# EAGLE design robot (EAGLE 6.3)
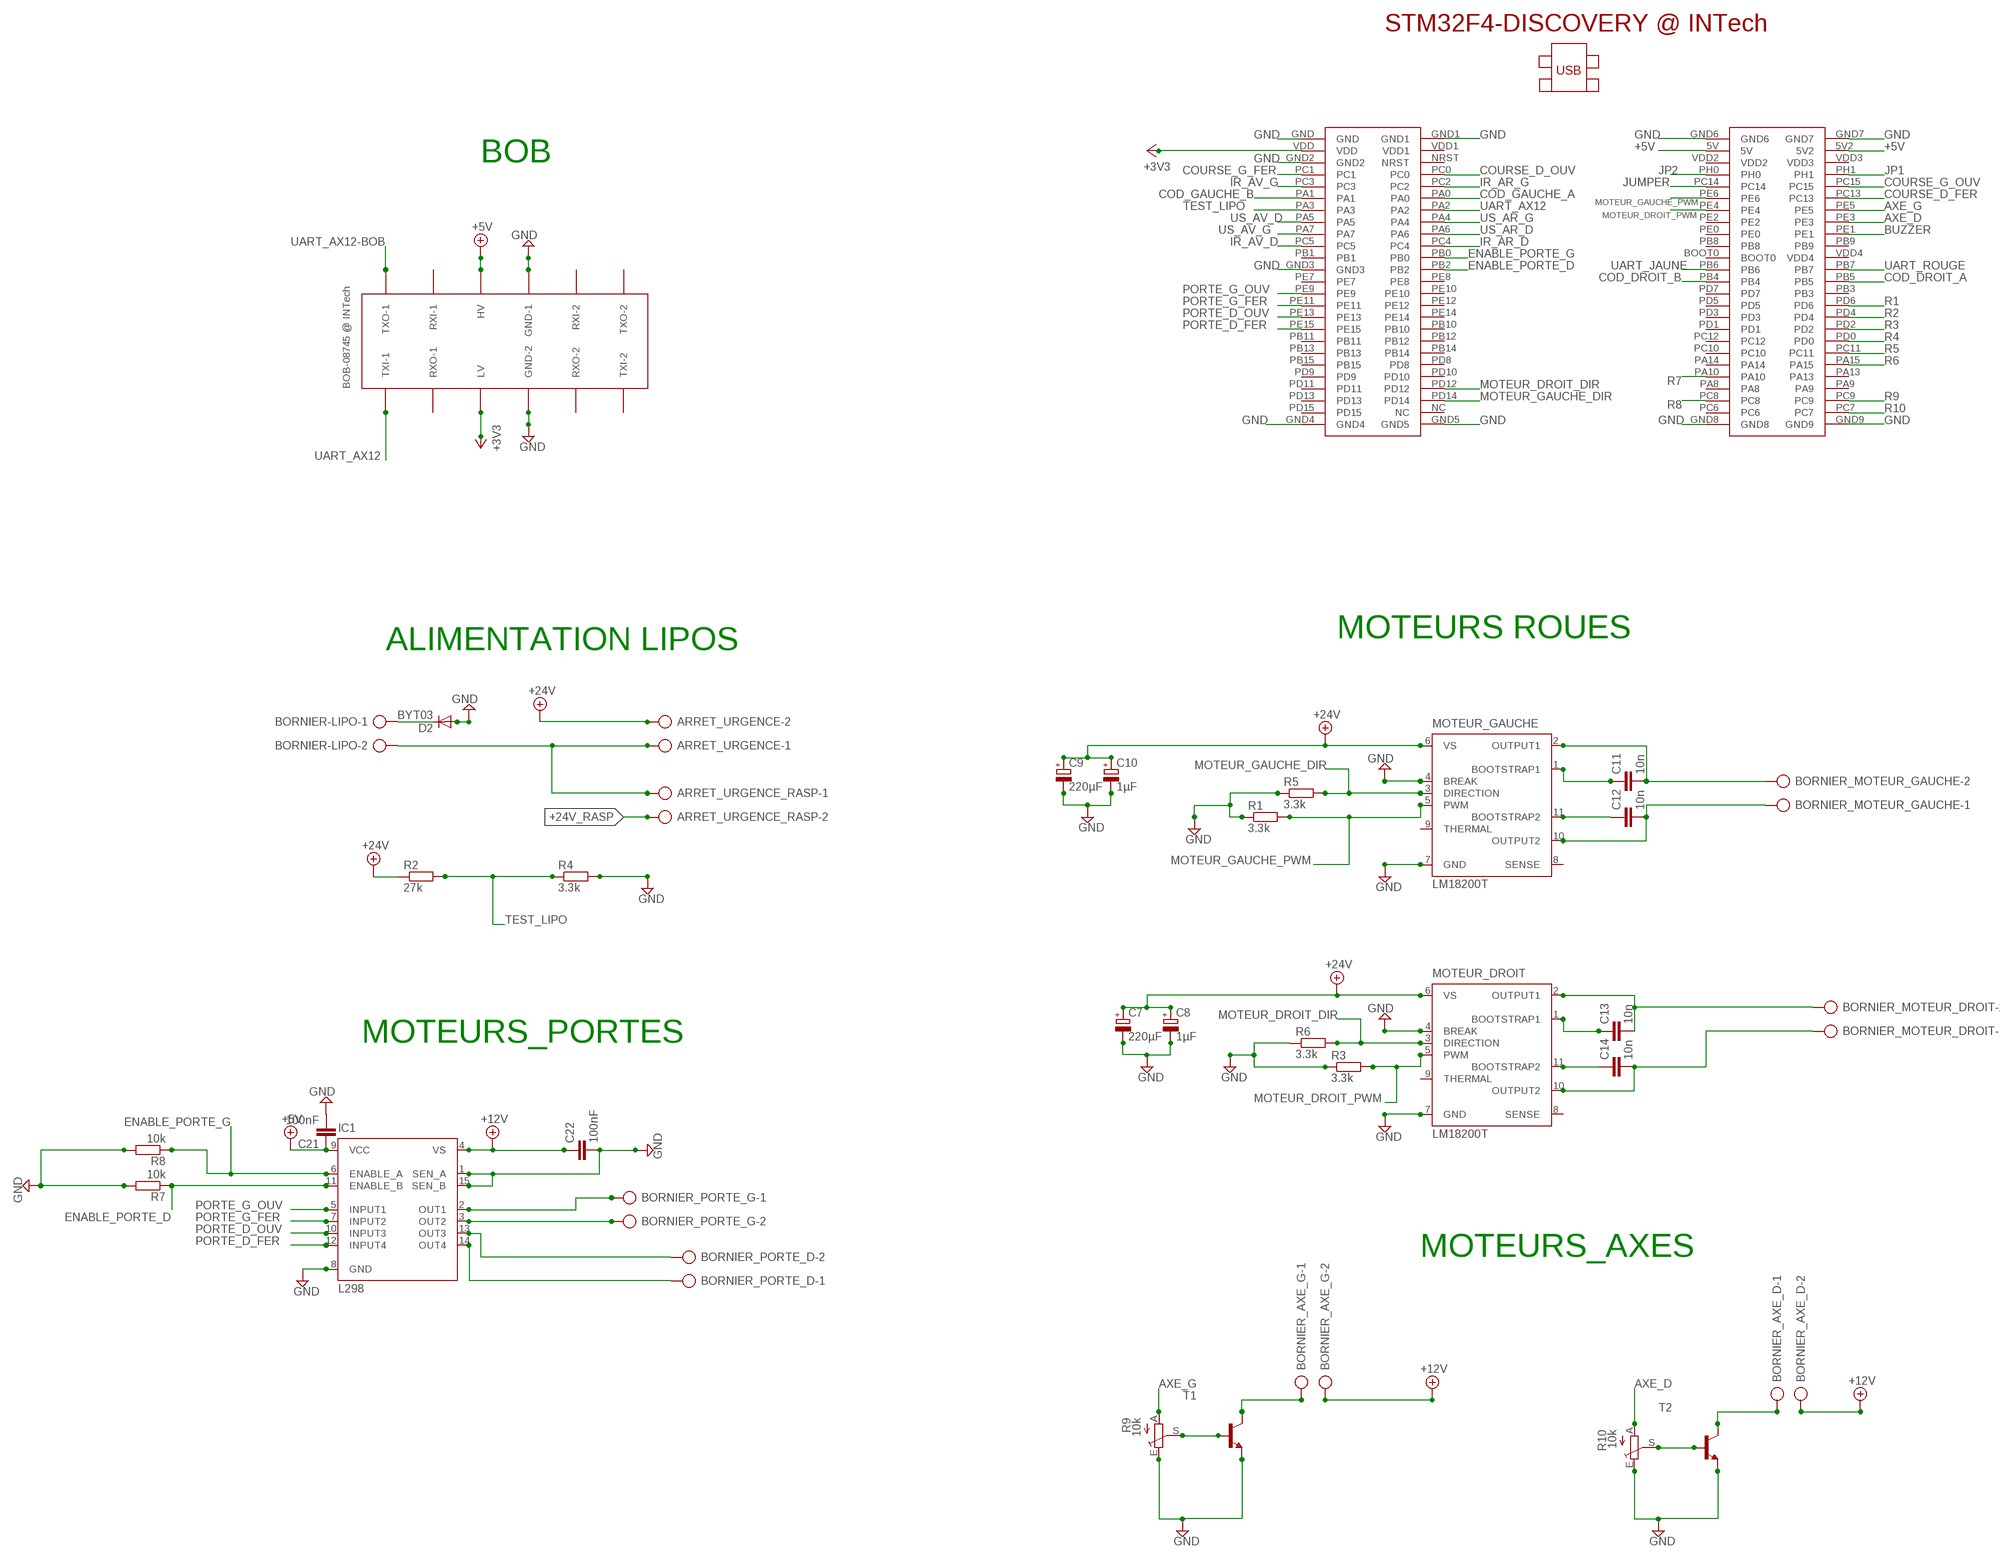
[diagram p0: schematic, sheet 1, part 1 of 2]
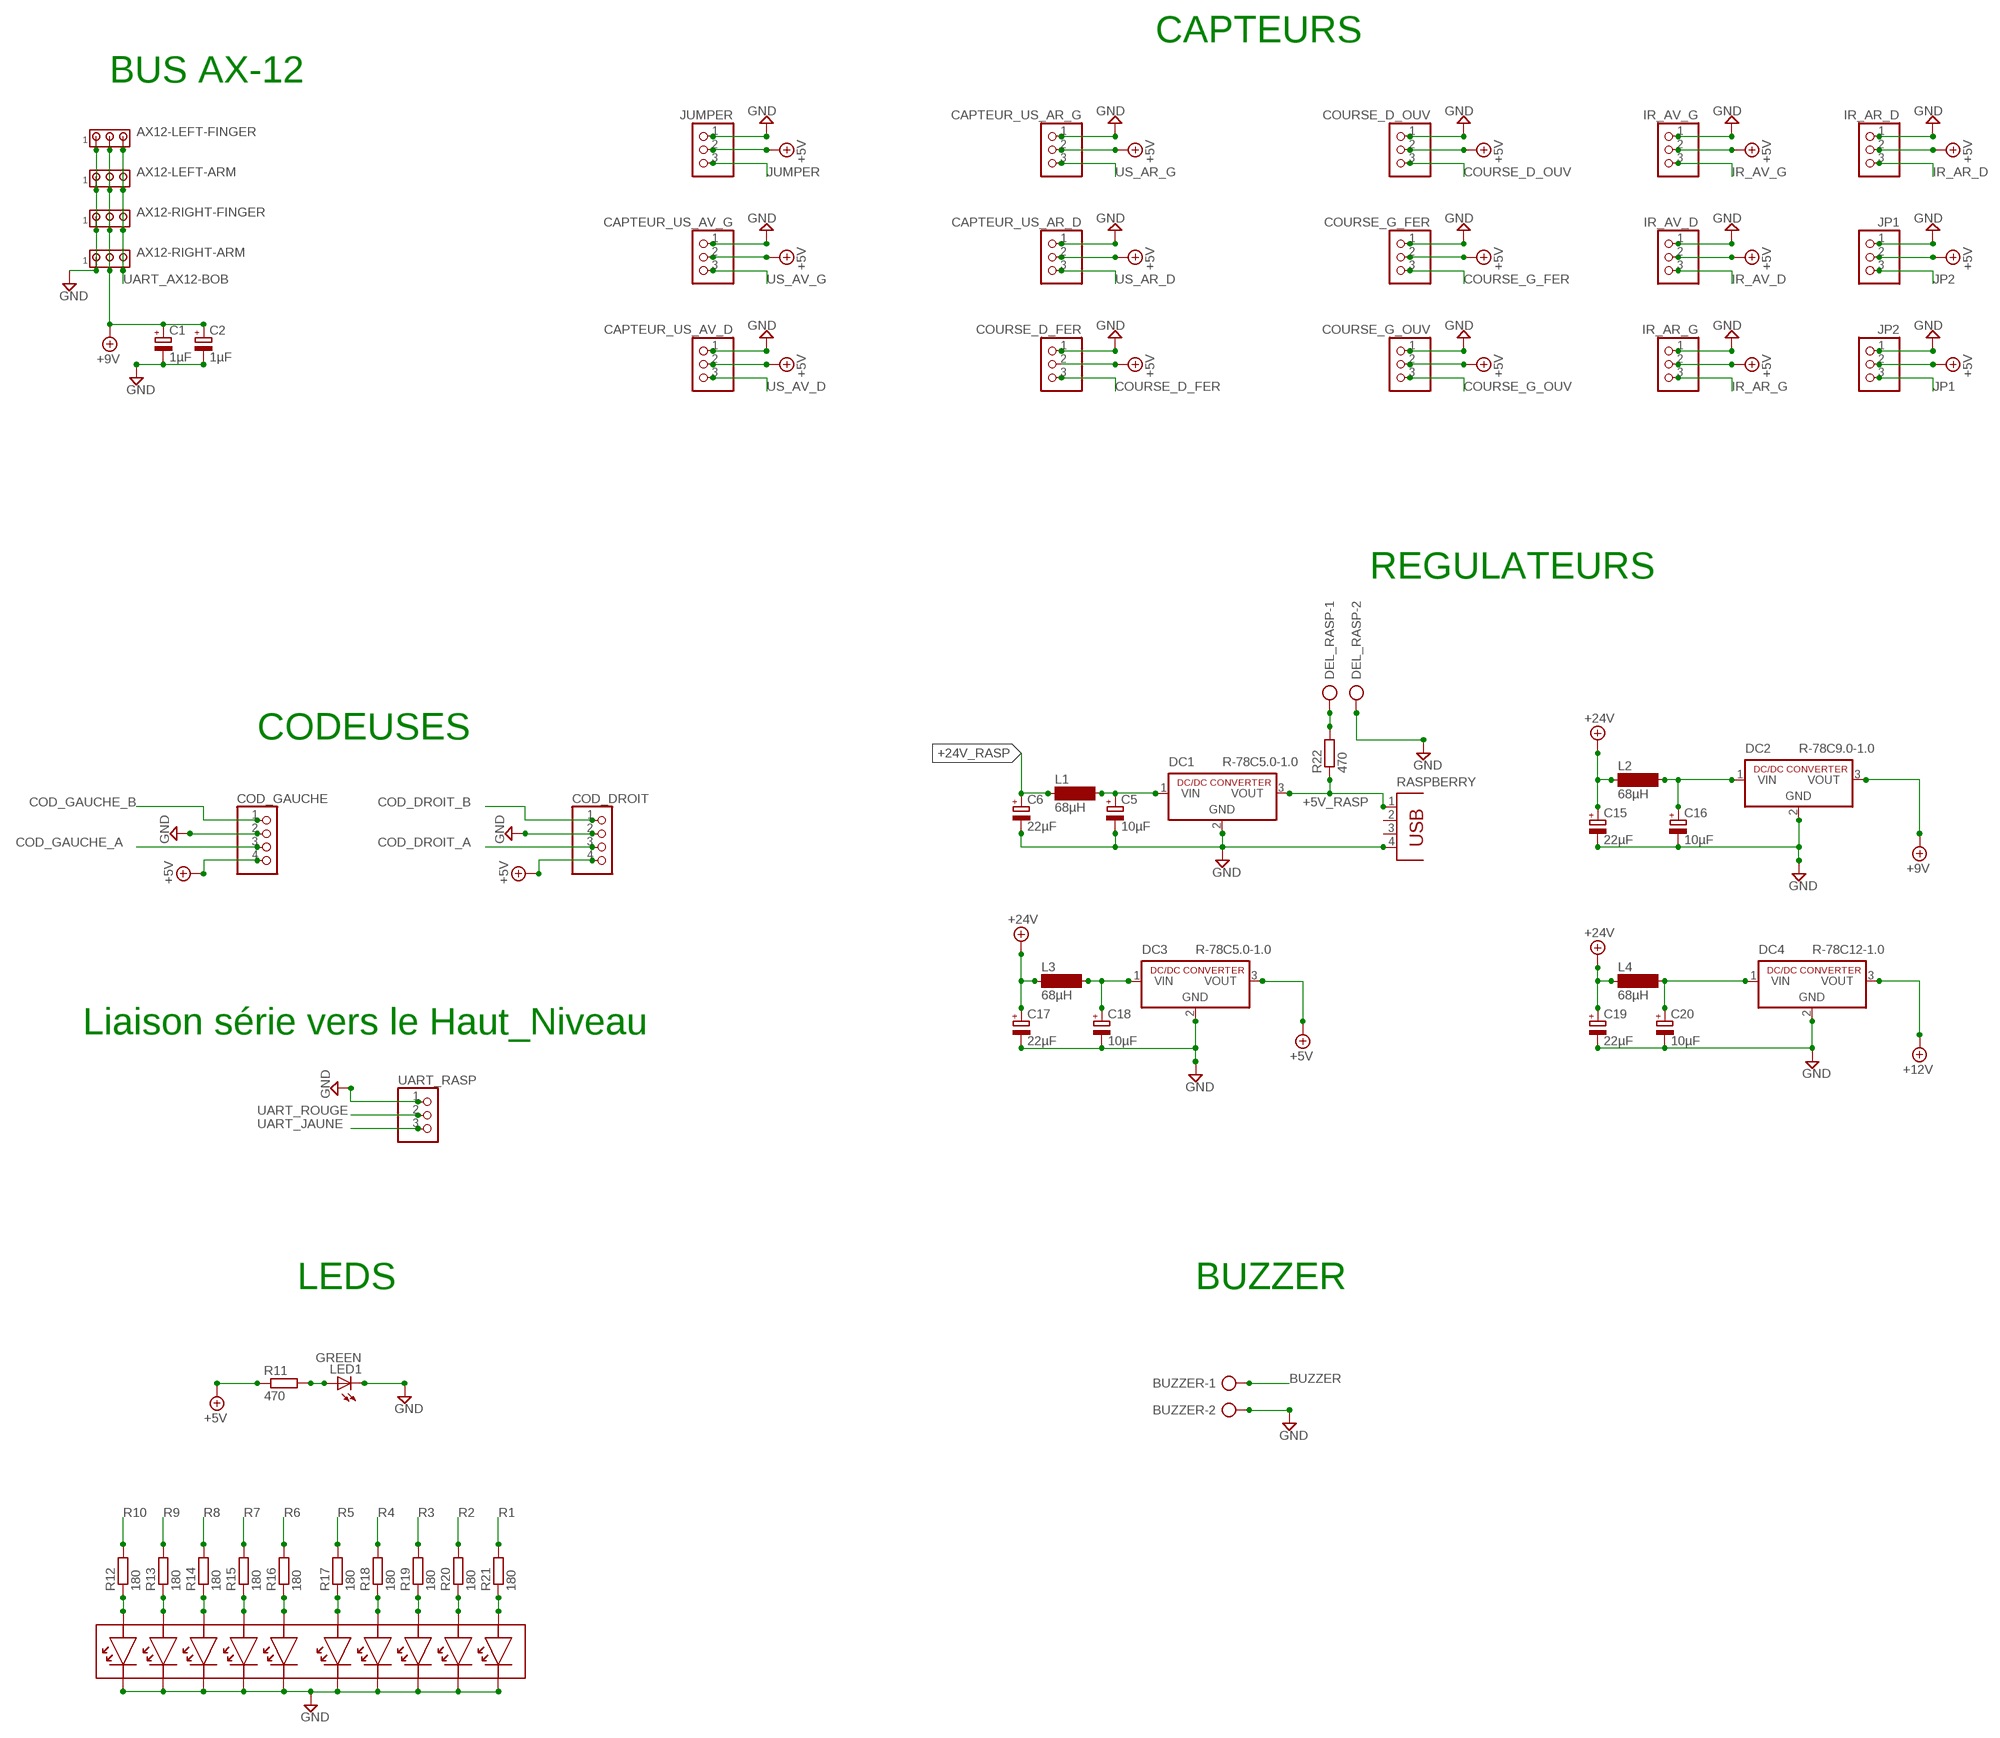
[diagram p1: schematic, sheet 1, part 2 of 2]

## Parts
ARRET_URGENCE  AK300/2  [AK300/2]
ARRET_URGENCE_RASP  AK300/2  [AK300/2]
AX12-LEFT-ARM  MTA03-100  [10X03MTA]
AX12-LEFT-FINGER  MTA03-100  [10X03MTA]
AX12-RIGHT-ARM  MTA03-100  [10X03MTA]
AX12-RIGHT-FINGER  MTA03-100  [10X03MTA]
BOB-08745  BOB-08745  [BOB-08745]
BORNIER-LIPO  AK300/2  [AK300/2]
BORNIER_AXE_D  AK300/2  [AK300/2]
BORNIER_AXE_G  AK300/2  [AK300/2]
BORNIER_MOTEUR_DROIT  AK300/2  [AK300/2]
BORNIER_MOTEUR_GAUCHE  AK300/2  [AK300/2]
BORNIER_PORTE_D  AK300/2  [AK300/2]
BORNIER_PORTE_G  AK300/2  [AK300/2]
BUZZER  AK300/2  [AK300/2]
C1  1µF  CPOL-EUE2,5-6E  [E2,5-6E]
C2  1µF  CPOL-EUE2,5-6E  [E2,5-6E]
C5  10µF  CPOL-EUE2,5-6E  [E2,5-6E]
C6  22µF  CPOL-EUE2,5-6E  [E2,5-6E]
C7  220µF  CPOL-EUE3.5-8  [E3,5-8]
C8  1µF  CPOL-EUE3.5-8  [E3,5-8]
C9  220µF  CPOL-EUE3.5-8  [E3,5-8]
C10  1µF  CPOL-EUE3.5-8  [E3,5-8]
C11  10n  C-EU050-025X075  [C050-025X075]
C12  10n  C-EU050-025X075  [C050-025X075]
C13  10n  C-EU050-025X075  [C050-025X075]
C14  10n  C-EU050-025X075  [C050-025X075]
C15  22µF  CPOL-EUE2,5-6E  [E2,5-6E]
C16  10µF  CPOL-EUE2,5-6E  [E2,5-6E]
C17  22µF  CPOL-EUE2,5-6E  [E2,5-6E]
C18  10µF  CPOL-EUE2,5-6E  [E2,5-6E]
C19  22µF  CPOL-EUE2,5-6E  [E2,5-6E]
C20  10µF  CPOL-EUE2,5-6E  [E2,5-6E]
C21  100nF  C-EU050-024X044  [C050-024X044]
C22  100nF  C-EU050-024X044  [C050-024X044]
CAPTEUR_US_AR_D  PINHD-1X3  [1X03]
CAPTEUR_US_AR_G  PINHD-1X3  [1X03]
CAPTEUR_US_AV_D  PINHD-1X3  [1X03]
CAPTEUR_US_AV_G  PINHD-1X3  [1X03]
COD_DROIT  PINHD-1X4  [1X04]
COD_GAUCHE  PINHD-1X4  [1X04]
COURSE_D_FER  PINHD-1X3  [1X03]
COURSE_D_OUV  PINHD-1X3  [1X03]
COURSE_G_FER  PINHD-1X3  [1X03]
COURSE_G_OUV  PINHD-1X3  [1X03]
D2  BYT03  [DO27-15]
DC1  R-78C5.0-1.0  [SIP3]
DC2  R-78C9.0-1.0  [SIP3]
DC3  R-78C5.0-1.0  [SIP3]
DC4  R-78C12-1.0  [SIP3]
DEL_RASP  AK300/2  [AK300/2]
IC1  L298  [MULTIWATT-15]
IR_AR_D  PINHD-1X3  [1X03]
IR_AR_G  PINHD-1X3  [1X03]
IR_AV_D  PINHD-1X3  [1X03]
IR_AV_G  PINHD-1X3  [1X03]
JP1  PINHD-1X3  [1X03]
JP2  PINHD-1X3  [1X03]
JUMPER  PINHD-1X3  [1X03]
L1  68µH  SD12K100  [SD12K100]
L2  68µH  SD12K100  [SD12K100]
L3  68µH  SD12K100  [SD12K100]
L4  68µH  SD12K100  [SD12K100]
LED1  GREEN  LED5MM  [LED5MM]
MOTEUR_DROIT  LM18200T  [TO-220-11]
MOTEUR_GAUCHE  LM18200T  [TO-220-11]
R1  3.3k  R-EU_0207/7  [0207/7]
R2  27k  R-EU_0207/10  [0207/10]
R3  3.3k  R-EU_0207/7  [0207/7]
R4  3.3k  R-EU_0207/10  [0207/10]
R5  3.3k  R-EU_0207/10  [0207/10]
R6  3.3k  R-EU_0207/10  [0207/10]
R7  10k  R-EU_0207/10  [0207/10]
R8  10k  R-EU_0207/10  [0207/10]
R9  10k  TRIM_EU-CA9H  [CA9H]
R10  10k  TRIM_EU-CA9H  [CA9H]
R11  470  R-EU_0207/2V  [0207/2V]
R12  180  R-EU_0207/2V  [0207/2V]
R13  180  R-EU_0207/2V  [0207/2V]
R14  180  R-EU_0207/2V  [0207/2V]
R15  180  R-EU_0207/2V  [0207/2V]
R16  180  R-EU_0207/2V  [0207/2V]
R17  180  R-EU_0207/2V  [0207/2V]
R18  180  R-EU_0207/2V  [0207/2V]
R19  180  R-EU_0207/2V  [0207/2V]
R20  180  R-EU_0207/2V  [0207/2V]
R21  180  R-EU_0207/2V  [0207/2V]
R22  470  R-EU_0204/7  [0204/7]
RASPBERRY  PN87520  [PN87520]
T1  2N5400-NPN-TO92-CBE  [TO92-CBE]
T2  2N5400-NPN-TO92-CBE  [TO92-CBE]
U$1  STM32F4-DISCOVERY  [STM32F4-DISCOVERY]
U$2  DELS10RACK  [DELS10RACK]
UART_RASP  PINHD-1X3  [1X03]

## Nets
+3V3: BOB-08745.LV U$1.VDD
+5V: BOB-08745.HV C21.1 CAPTEUR_US_AR_D.2 CAPTEUR_US_AR_G.2 CAPTEUR_US_AV_D.2 CAPTEUR_US_AV_G.2 COD_DROIT.4 COD_GAUCHE.4 COURSE_D_FER.2 COURSE_D_OUV.2 COURSE_G_FER.2 COURSE_G_OUV.2 DC3.3(VOUT) IC1.9(VCC) IR_AR_D.2 IR_AR_G.2 IR_AV_D.2 IR_AV_G.2 JP1.2 JP2.2 JUMPER.2 R11.1 U$1.5V U$1.5V2
+5V_RASP: DC1.3(VOUT) R22.1 RASPBERRY.1
+9V: AX12-LEFT-ARM.2 AX12-LEFT-FINGER.2 AX12-RIGHT-ARM.2 AX12-RIGHT-FINGER.2 C1.+ C2.+ DC2.3(VOUT)
+12V: BORNIER_AXE_D.2 BORNIER_AXE_G.2 C22.1 DC4.3(VOUT) IC1.4(VS)
+24V: ARRET_URGENCE.2 C7.+ C8.+ C9.+ C10.+ C15.+ C17.+ C19.+ L2.1 L3.1 L4.1 MOTEUR_DROIT.6(VS) MOTEUR_GAUCHE.6(VS) R2.1
+24V_LIPO: ARRET_URGENCE.1 ARRET_URGENCE_RASP.1 BORNIER-LIPO.2
+24V_RASP: ARRET_URGENCE_RASP.2 C6.+ L1.1
AXE_D: R10.A U$1.PE3
AXE_G: R9.A U$1.PE5
BUZZER: BUZZER.1 U$1.PE1
COD_DROIT_A: COD_DROIT.3 U$1.PB5
COD_DROIT_B: COD_DROIT.1 U$1.PB4
COD_GAUCHE_A: COD_GAUCHE.3 U$1.PA0
COD_GAUCHE_B: COD_GAUCHE.1 U$1.PA1
COURSE_D_FER: COURSE_D_FER.3 U$1.PC13
COURSE_D_OUV: COURSE_D_OUV.3 U$1.PC0
COURSE_G_FER: COURSE_G_FER.3 U$1.PC1
COURSE_G_OUV: COURSE_G_OUV.3 U$1.PC15
ENABLE_PORTE_D: IC1.11(ENABLE_B) R7.1 U$1.PB2
ENABLE_PORTE_G: IC1.6(ENABLE_A) R8.1 U$1.PB0
GND: AX12-LEFT-ARM.1 AX12-LEFT-FINGER.1 AX12-RIGHT-ARM.1 AX12-RIGHT-FINGER.1 BOB-08745.GND-1 BOB-08745.GND-2 BUZZER.2 C1.- C2.- C5.- C6.- C7.- C8.- C9.- C10.- C15.- C16.- C17.- C18.- C19.- C20.- C21.2 C22.2 CAPTEUR_US_AR_D.1 CAPTEUR_US_AR_G.1 CAPTEUR_US_AV_D.1 CAPTEUR_US_AV_G.1 COD_DROIT.2 COD_GAUCHE.2 COURSE_D_FER.1 COURSE_D_OUV.1 COURSE_G_FER.1 COURSE_G_OUV.1 D2.A DC1.2(GND) DC2.2(GND) DC3.2(GND) DC4.2(GND) DEL_RASP.2 IC1.1(SEN_A) IC1.8(GND) IC1.15(SEN_B) IR_AR_D.1 IR_AR_G.1 IR_AV_D.1 IR_AV_G.1 JP1.1 JP2.1 JUMPER.1 LED1.K(C) MOTEUR_DROIT.4(BREAK) MOTEUR_DROIT.7(GND) MOTEUR_GAUCHE.4(BREAK) MOTEUR_GAUCHE.7(GND) R1.1 R3.1 R4.2 R5.1 R6.1 R7.2 R8.2 R9.E R10.E RASPBERRY.4 T1.E T2.E U$1.GND U$1.GND1 U$1.GND2 U$1.GND3 U$1.GND4 U$1.GND5 U$1.GND6 U$1.GND7 U$1.GND8 U$1.GND9 U$2.11 U$2.12 U$2.13 U$2.14 U$2.15 U$2.16 U$2.17 U$2.18 U$2.19 U$2.20 UART_RASP.1
IR_AR_D: IR_AR_D.3 U$1.PC4
IR_AR_G: IR_AR_G.3 U$1.PC2
IR_AV_D: IR_AV_D.3 U$1.PC5
IR_AV_G: IR_AV_G.3 U$1.PC3
JP1: JP2.3 U$1.PH1
JP2: JP1.3 U$1.PH0
JUMPER: JUMPER.3 U$1.PC14
MOTEUR_DROIT_DIR: MOTEUR_DROIT.3(DIRECTION) R6.2 U$1.PD12
MOTEUR_DROIT_PWM: MOTEUR_DROIT.5(PWM) R3.2 U$1.PE4
MOTEUR_GAUCHE_DIR: MOTEUR_GAUCHE.3(DIRECTION) R5.2 U$1.PD14
MOTEUR_GAUCHE_PWM: MOTEUR_GAUCHE.5(PWM) R1.2 U$1.PE6
N$1: R10.S T2.B
N$2: R9.S T1.B
N$3: DEL_RASP.1 R22.2
N$4: BORNIER-LIPO.1 D2.C
N$5: BORNIER_AXE_G.1 T1.C
N$6: LED1.A R11.2
N$7: BORNIER_PORTE_D.1 IC1.14(OUT4)
N$8: C14.1 MOTEUR_DROIT.11(BOOTSTRAP2)
N$9: BORNIER_MOTEUR_GAUCHE.1 C12.2 MOTEUR_GAUCHE.10(OUTPUT2)
N$10: C11.1 MOTEUR_GAUCHE.1(BOOTSTRAP1)
N$11: BORNIER_MOTEUR_DROIT.2 C13.2 MOTEUR_DROIT.2(OUTPUT1)
N$12: BORNIER_MOTEUR_DROIT.1 C14.2 MOTEUR_DROIT.10(OUTPUT2)
N$13: C20.+ DC4.1(VIN) L4.2
N$14: C13.1 MOTEUR_DROIT.1(BOOTSTRAP1)
N$15: C5.+ DC1.1(VIN) L1.2
N$16: BORNIER_MOTEUR_GAUCHE.2 C11.2 MOTEUR_GAUCHE.2(OUTPUT1)
N$18: C18.+ DC3.1(VIN) L3.2
N$22: C12.1 MOTEUR_GAUCHE.11(BOOTSTRAP2)
N$24: C16.+ DC2.1(VIN) L2.2
N$31: R12.1 U$2.10
N$32: R13.1 U$2.9
N$33: BORNIER_AXE_D.1 T2.C
N$34: R14.1 U$2.8
N$35: BORNIER_PORTE_G.1 IC1.2(OUT1)
N$36: R15.1 U$2.7
N$37: BORNIER_PORTE_G.2 IC1.3(OUT2)
N$38: BORNIER_PORTE_D.2 IC1.13(OUT3)
N$40: R16.1 U$2.6
N$41: R17.1 U$2.5
N$42: R18.1 U$2.4
N$43: R19.1 U$2.3
N$44: R20.1 U$2.2
N$45: R21.1 U$2.1
PORTE_D_FER: IC1.12(INPUT4) U$1.PE15
PORTE_D_OUV: IC1.10(INPUT3) U$1.PE13
PORTE_G_FER: IC1.7(INPUT2) U$1.PE11
PORTE_G_OUV: IC1.5(INPUT1) U$1.PE9
R1: R21.2 U$1.PD6
R2: R20.2 U$1.PD4
R3: R19.2 U$1.PD2
R4: R18.2 U$1.PD0
R5: R17.2 U$1.PC11
R6: R16.2 U$1.PA15
R7: R15.2 U$1.PA10
R8: R14.2 U$1.PC8
R9: R13.2 U$1.PC9
R10: R12.2 U$1.PC7
TEST_LIPO: R2.2 R4.1 U$1.PA3
UART_AX12: BOB-08745.TXI-1 U$1.PA2
UART_AX12-BOB: AX12-LEFT-ARM.3 AX12-LEFT-FINGER.3 AX12-RIGHT-ARM.3 AX12-RIGHT-FINGER.3 BOB-08745.TXO-1
UART_JAUNE: U$1.PB6 UART_RASP.3
UART_ROUGE: U$1.PB7 UART_RASP.2
US_AR_D: CAPTEUR_US_AR_D.3 U$1.PA6
US_AR_G: CAPTEUR_US_AR_G.3 U$1.PA4
US_AV_D: CAPTEUR_US_AV_D.3 U$1.PA5
US_AV_G: CAPTEUR_US_AV_G.3 U$1.PA7
Unconnected: BOB-08745.RXI-1 BOB-08745.RXI-2 BOB-08745.RXO-1 BOB-08745.RXO-2 BOB-08745.TXI-2 BOB-08745.TXO-2 MOTEUR_DROIT.8(SENSE) MOTEUR_DROIT.9(THERMAL) MOTEUR_GAUCHE.8(SENSE) MOTEUR_GAUCHE.9(THERMAL) RASPBERRY.2 RASPBERRY.3 U$1.BOOT0 U$1.NC U$1.NRST U$1.PA8 U$1.PA9 U$1.PA13 U$1.PA14 U$1.PB1 U$1.PB3 U$1.PB8 U$1.PB9 U$1.PB10 U$1.PB11 U$1.PB12 U$1.PB13 U$1.PB14 U$1.PB15 U$1.PC6 U$1.PC10 U$1.PC12 U$1.PD1 U$1.PD3 U$1.PD5 U$1.PD7 U$1.PD8 U$1.PD9 U$1.PD10 U$1.PD11 U$1.PD13 U$1.PD15 U$1.PE0 U$1.PE2 U$1.PE7 U$1.PE8 U$1.PE10 U$1.PE12 U$1.PE14 U$1.VDD1 U$1.VDD2 U$1.VDD3 U$1.VDD4

## Notes on the sheet
- CAPTEURS
- BUS AX-12
- BOB
- REGULATEURS
- MOTEURS ROUES
- ALIMENTATION LIPOS
- CODEUSES
- Liaison série vers le Haut_Niveau
- MOTEURS_PORTES
- LEDS | BUZZER
- MOTEURS_AXES

## Library data of the parts
ARRET_URGENCE ARRET_URGENCE_RASP BORNIER-LIPO BORNIER_AXE_D BORNIER_AXE_G BORNIER_MOTEUR_DROIT BORNIER_MOTEUR_GAUCHE BORNIER_PORTE_D BORNIER_PORTE_G BUZZER DEL_RASP = con-ptr500:AK300/2: CONNECTOR; OC_FARNELL: unknown; OC_NEWARK: unknown
AX12-LEFT-ARM AX12-LEFT-FINGER AX12-RIGHT-ARM AX12-RIGHT-FINGER = con-amp:MTA03-100: AMP connector
BOB-08745 = BOB-08745_CF_INTech:BOB-08745: Convertisseur de niveau logique BOB-08745
C1 C2 C5 C6 C15-C20 = resistor:CPOL-EU: POLARIZED CAPACITOR, European symbol
C7-C10 = rcl:CPOL-EU: POLARIZED CAPACITOR, European symbol
C11-C14 = rcl:C-EU: CAPACITOR, European symbol
C21 C22 = resistor:C-EU: CAPACITOR, European symbol
CAPTEUR_US_AR_D CAPTEUR_US_AR_G CAPTEUR_US_AV_D CAPTEUR_US_AV_G COURSE_D_FER COURSE_D_OUV COURSE_G_FER COURSE_G_OUV IR_AR_D IR_AR_G IR_AV_D IR_AV_G JP1 JP2 JUMPER UART_RASP = pinhead:PINHD-1X3: PIN HEADER
COD_DROIT COD_GAUCHE = pinhead:PINHD-1X4: PIN HEADER
D2 = diode:BYT03: DIODE ultra fast
DC1-DC4 = dc-dc-converter:R-78C*-1.0: INNOLINE DC/DC-Converter 1.0 AMP SIP3 Single Output Source: Data sheet <http://www.mikrocontroller.net/attachment/150645/157764-da-01-en-DC_DC_WANDLER_R_78C5_0_1_0.pdf>
IC1 = st-microelectronics:L298: DUAL FULL-BRIDGE DRIVER; MPN: L298N; OC_FARNELL: 1589425; OC_NEWARK: 32M1527
L1-L4 = inductor-neosid:SD12: INDUCTOR nominal inductance; OC_FARNELL: unknown; OC_NEWARK: unknown
LED1 = led:LED: LED OSRAM: - CHIPLED LG R971, LG N971, LY N971, LG Q971, LY Q971, LO R971, LY R971 LH N974, LH R974 LS Q976, LO Q976, LY Q976 LO Q996 - Hyper CHIPLED LW Q18S LB Q993, LB Q99A, LB R99A - SideLED LS A670, LO A670, LY A670, LG A670, LP A670 LB A673, LV A673, LT A673, LW A673 LH A674 LY A675 LS A676, LA A676, LO A676, LY A676, LW A676 LS A679, LY A679, LG A679 - Hyper Micro SIDELED® LS Y876, LA Y876, LO Y876, LY Y876 LT Y87S - SmartLED LW L88C, LW L88S LB L89C, LB L89S, LG L890 LS L89K, LO L89K, LY L89K LS L896, LA L896, LO L896, LY L896 - TOPLED LS T670, LO T670, LY T670, LG T670, LP T670 LSG T670, LSP T670, LSY T670, LOP T670, LYG T670 LG T671, LOG T671, LSG T671 LB T673, LV T673, LT T673, LW T673 LH T674 LS T676, LA T676, LO T676, LY T676, LB T676, LH T676, LSB T676, LW T676 LB T67C, LV T67C, LT T67C, LS T67K, LO T67K, LY T67K, LW E67C LS E67B, LA E67B, LO E67B, LY E67B, LB E67C, LV E67C, LT E67C LW T67C LS T679, LY T679, LG T679 LS T770, LO T770, LY T770, LG T770, LP T770 LB T773, LV T773, LT T773, LW T773 LH T774 LS E675, LA E675, LY E675, LS T675 LS T776, LA T776, LO T776, LY T776, LB T776 LHGB T686 LT T68C, LB T68C - Hyper Mini TOPLED® LB M676 - Mini TOPLED Santana® LG M470 LS M47K, LO M47K, LY M47K Source: http://www.osram.convergy.de LUXEON: - LUMILED® LXK2-PW12-R00, LXK2-PW12-S00, LXK2-PW14-U00, LXK2-PW14-V00 LXK2-PM12-R00, LXK2-PM12-S00, LXK2-PM14-U00 LXK2-PE12-Q00, LXK2-PE12-R00, LXK2-PE12-S00, LXK2-PE14-T00, LXK2-PE14-U00 LXK2-PB12-K00, LXK2-PB12-L00, LXK2-PB12-M00, LXK2-PB14-N00, LXK2-PB14-P00, LXK2-PB14-Q00 LXK2-PR12-L00, LXK2-PR12-M00, LXK2-PR14-Q00, LXK2-PR14-R00 LXK2-PD12-Q00, LXK2-PD12-R00, LXK2-PD12-S00 LXK2-PH12-R00, LXK2-PH12-S00 LXK2-PL12-P00, LXK2-PL12-Q00, LXK2-PL12-R00 Source: www.luxeon.com KINGBRIGHT: KA-3528ASYC Source: www.kingbright.com
MOTEUR_DROIT MOTEUR_GAUCHE = national-semiconductor:LM18200T: 3A, 55V H-Bridge Motor Control SourcE: http://cache.national.com/ds/LM/LMD18200.pdf; OC_FARNELL: unknown; OC_NEWARK: unknown
R1-R8 R11-R22 = resistor:R-EU_: RESISTOR, European symbol
R9 R10 = pot:TRIM_EU-: POTENTIOMETER
RASPBERRY = con-berg:PN87520: BERG USB connector; OC_FARNELL: unknown; OC_NEWARK: unknown
T1 T2 = transistor:*-NPN-: NPN Transistror BF959 corrected 2008.03.06
U$1 = STM32F4-DISCOVERY_CF_INTECH:STM32F4-DISCOVERY
U$2 = DELS 10 Rack:DELS10RACK: Rack de 10 Dels modèle LTA1000G

## Board
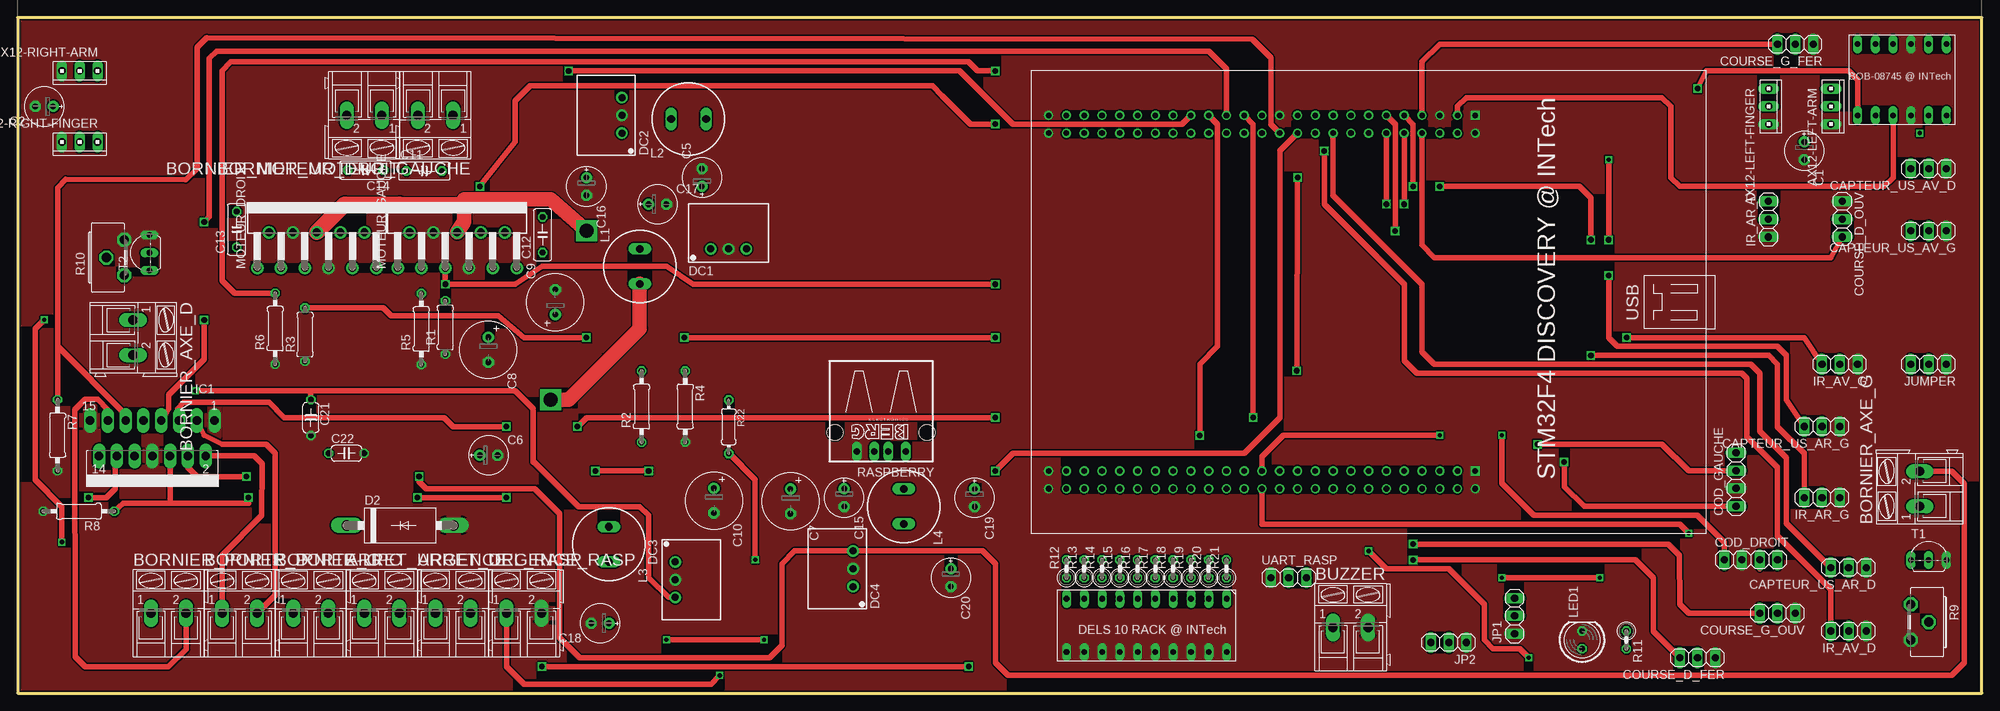
[diagram p2: board, top side]
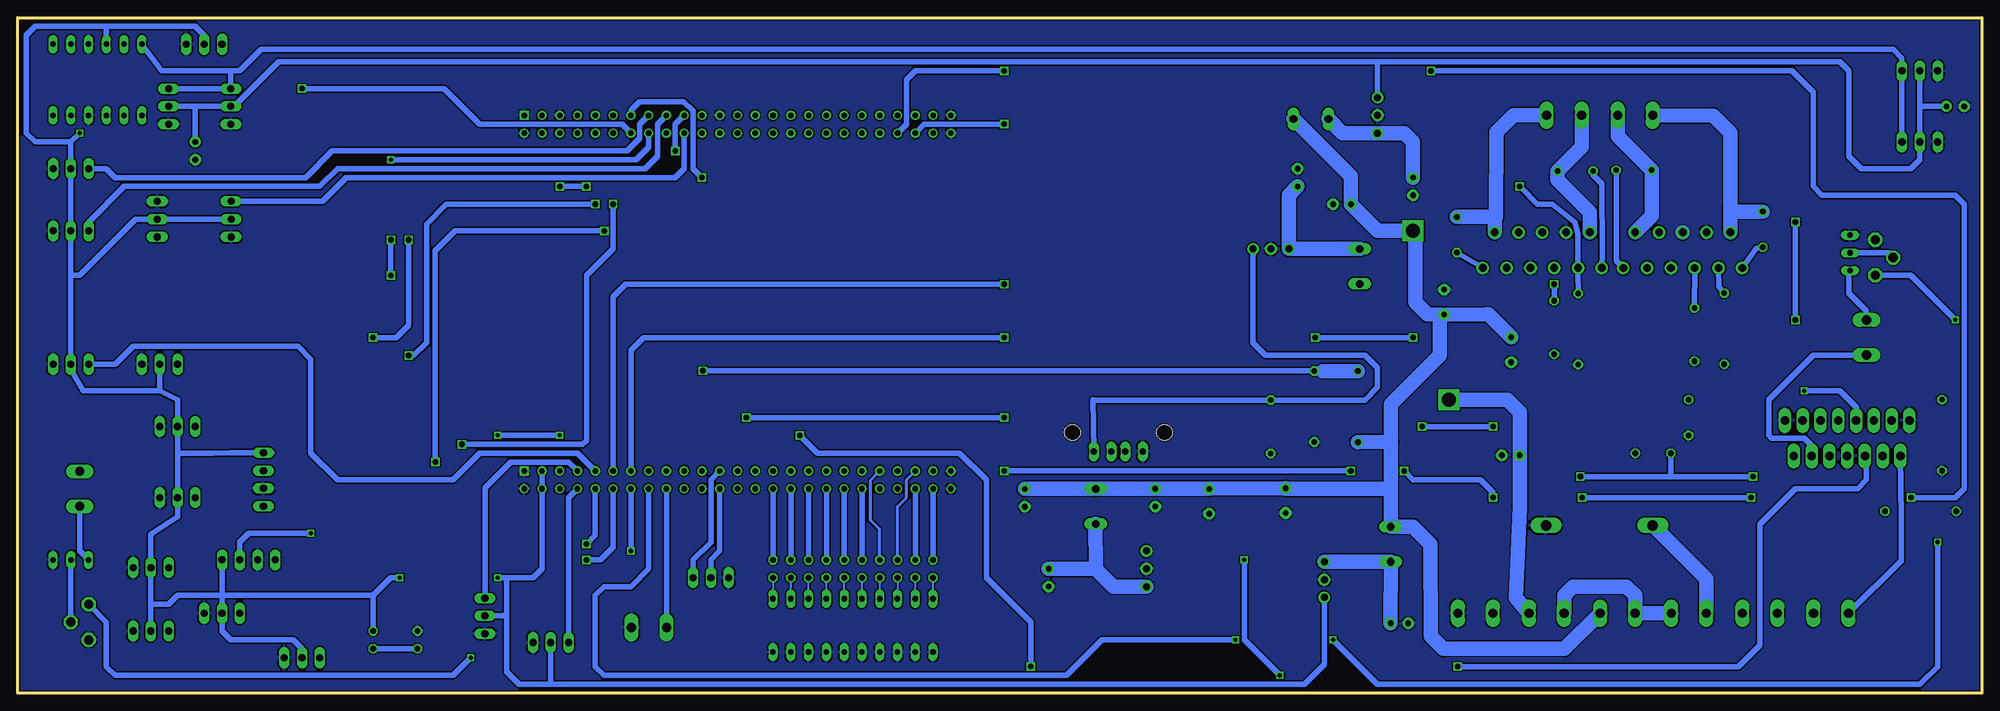
[diagram p3: board, bottom side, seen from below]

Size 280.67 x 96.52 mm. Coordinates in mm from the lower left corner, seen from the top.
Outline: 0,96.52 0,0 280.67,0 280.67,96.52 0,96.52
Copper layers (1*16): Top 0.035mm / dielectric 1.5mm / Bottom 0.035mm
Design rules "default *": minimum track width 8mil, minimum drill 18mil, track to track 8mil, track to pad 8mil, pad to pad 8mil, via to via 8mil, smd to smd 8mil, copper to edge 8mil, drill to drill 8mil, minimum pad ring 10mil, minimum via ring 8mil, stop-mask expansion 4mil, vias tented up to drill 0mil, thermal gap 10mil

### Footprints (pad centres in the part's own frame; a part is rotated, then mirrored left to right if it is on the bottom)
AK300/2 = drill 1.321 long: 1 -2.515,0; 2 2.489,0
10X03MTA = drill 1.016 long: 1 2.54,0; 2 0,0; 3 -2.54,0
BOB-08745 = drill 0.8 long: GND-1 1.27,5.08; GND-2 1.27,-5.08; HV -1.27,5.08; LV -1.27,-5.08; RXI-1 -3.81,5.08; RXI-2 3.81,5.08; RXO-1 -3.81,-5.08; RXO-2 3.81,-5.08; TXI-1 -6.35,-5.08; TXI-2 6.35,-5.08; TXO-1 -6.35,5.08; TXO-2 6.35,5.08
E2,5-6E = drill 0.813 pad 1.575: + -1.27,0 | drill 0.813 pad 1.575 octagon: - 1.27,0
E3,5-8 = drill 0.813 pad 1.6: + -1.778,0 | drill 0.813 pad 1.6 octagon: - 1.778,0
C050-025X075 = drill 0.813 octagon: 1 -2.54,0; 2 2.54,0
C050-024X044 = drill 0.813 octagon: 1 -2.54,0; 2 2.54,0
1X03 = drill 1.016 long: 1 -2.54,0; 2 0,0; 3 2.54,0
1X04 = drill 1.016 long: 1 -3.81,0; 2 -1.27,0; 3 1.27,0; 4 3.81,0
DO27-15 = drill 1.499 long: A 7.62,0; C -7.62,0
SIP3 = drill 1 pad 1.676: 1 -2.54,0; 2 0,0; 3 2.54,0
MULTIWATT-15 = drill 1.2 long: 1 -8.89,-7.62; 2 -7.62,-2.54; 3 -6.35,-7.62; 4 -5.08,-2.54; 5 -3.81,-7.62; 6 -2.54,-2.54; 7 -1.27,-7.62; 8 0,-2.54; 9 1.27,-7.62; 10 2.54,-2.54; 11 3.81,-7.62; 12 5.08,-2.54; 13 6.35,-7.62; 14 7.62,-2.54; 15 8.89,-7.62
SD12K100 = drill 1.1 long: 1 -2.5,0; 2 2.5,0
LED5MM = drill 0.813 octagon: A -1.27,0; K 1.27,0
TO-220-11 = drill 1.1 pad 1.778: 1 -8.5,-9.37; 2 -6.8,-4.29; 3 -5.1,-9.37; 4 -3.4,-4.29; 5 -1.7,-9.37; 6 0,-4.29; 7 1.7,-9.37; 8 3.4,-4.29; 9 5.1,-9.37; 10 6.8,-4.29; 11 8.5,-9.37
0207/7 = drill 0.813 octagon: 1 -3.81,0; 2 3.81,0
0207/10 = drill 0.813 octagon: 1 -5.08,0; 2 5.08,0
CA9H = drill 1.321 octagon: A -2.54,0; E 2.54,0; S 0,2.54
0207/2V = drill 0.813 octagon: 1 -1.27,0; 2 1.27,0
0204/7 = drill 0.813 octagon: 1 -3.81,0; 2 3.81,0
PN87520 = drill 0.95 long: 1 -3.5,2.71; 2 -1,2.71; 3 1,2.71; 4 3.5,2.71 | hole 2.3: -6.57,0; 6.57,0
TO92-CBE = drill 0.813 long: B 0,0; C -2.54,0; E 2.54,0
STM32F4-DISCOVERY = drill 0.8: 5V 24.13,12.7; 5V2 26.67,12.7; BOOT0 24.13,-10.16; GND1 -24.13,15.24; GND2 -26.67,10.16; GND3 -26.67,-12.7; GND4 -26.67,-45.72; GND5 -24.13,-45.72; GND7 26.67,15.24; GND8 24.13,-45.72; GND9 26.67,-45.72; NC -24.13,-43.18; NRST -24.13,10.16; PA0 -24.13,2.54; PA1 -26.67,2.54; PA2 -24.13,0; PA3 -26.67,0; PA4 -24.13,-2.54; PA5 -26.67,-2.54; PA6 -24.13,-5.08; PA7 -26.67,-5.08; PA8 24.13,-38.1; PA9 26.67,-38.1; PA10 24.13,-35.56; PA13 26.67,-35.56; PA14 24.13,-33.02; PA15 26.67,-33.02; PB0 -24.13,-10.16; PB1 -26.67,-10.16; PB2 -24.13,-12.7; PB3 26.67,-17.78; PB4 24.13,-15.24; PB5 26.67,-15.24; PB6 24.13,-12.7; PB7 26.67,-12.7; PB8 24.13,-7.62; PB9 26.67,-7.62; PB10 -24.13,-25.4; PB11 -26.67,-27.94; PB12 -24.13,-27.94; PB13 -26.67,-30.48; PB14 -24.13,-30.48; PB15 -26.67,-33.02; PC0 -24.13,7.62; PC1 -26.67,7.62; PC2 -24.13,5.08; PC3 -26.67,5.08; PC4 -24.13,-7.62; PC5 -26.67,-7.62; PC6 24.13,-43.18; PC7 26.67,-43.18; PC8 24.13,-40.64; PC9 26.67,-40.64; PC10 24.13,-30.48; PC11 26.67,-30.48; PC12 24.13,-27.94; PC13 26.67,2.54; PC14 24.13,5.08; PC15 26.67,5.08; PD0 26.67,-27.94; PD1 24.13,-25.4; PD2 26.67,-25.4; PD3 24.13,-22.86; PD4 26.67,-22.86; PD5 24.13,-20.32; PD6 26.67,-20.32; PD7 24.13,-17.78; PD8 -24.13,-33.02; PD9 -26.67,-35.56; PD10 -24.13,-35.56; PD11 -26.67,-38.1; PD12 -24.13,-38.1; PD13 -26.67,-40.64; PD14 -24.13,-40.64; PD15 -26.67,-43.18; PE0 24.13,-5.08; PE1 26.67,-5.08; PE2 24.13,-2.54; PE3 26.67,-2.54; PE4 24.13,0; PE5 26.67,0; PE6 24.13,2.54; PE7 -26.67,-15.24; PE8 -24.13,-15.24; PE9 -26.67,-17.78; PE10 -24.13,-17.78; PE11 -26.67,-20.32; PE12 -24.13,-20.32; PE13 -26.67,-22.86; PE14 -24.13,-22.86; PE15 -26.67,-25.4; PH0 24.13,7.62; PH1 26.67,7.62; VDD -26.67,12.7; VDD1 -24.13,12.7; VDD2 24.13,10.16; VDD3 26.67,10.16; VDD4 26.67,-10.16 | drill 0.8 square: GND -26.67,15.24; GND6 24.13,15.24
DELS10RACK = drill 0.8 long: 1 -11.43,-3.81; 2 -8.89,-3.81; 3 -6.35,-3.81; 4 -3.81,-3.81; 5 -1.27,-3.81; 6 1.27,-3.81; 7 3.81,-3.81; 8 6.35,-3.81; 9 8.89,-3.81; 10 11.43,-3.81; 11 -11.43,3.81; 12 -8.89,3.81; 13 -6.35,3.81; 14 -3.81,3.81; 15 -1.27,3.81; 16 1.27,3.81; 17 3.81,3.81; 18 6.35,3.81; 19 8.89,3.81; 20 11.43,3.81

### Placement (x,y rotation side)
ARRET_URGENCE  52.07,11.43 0 top
ARRET_URGENCE_RASP  62.23,11.43 0 top
AX12-LEFT-ARM  259.08,83.82 270 top
AX12-LEFT-FINGER  250.19,83.82 270 top
AX12-RIGHT-ARM  8.89,88.9 180 top
AX12-RIGHT-FINGER  8.89,78.74 180 top
BOB-08745  269.24,87.63 0 top
BORNIER-LIPO  41.91,11.43 0 top
BORNIER_AXE_D  16.51,50.8 270 top
BORNIER_AXE_G  271.78,29.21 90 top
BORNIER_MOTEUR_DROIT  49.53,82.55 180 top
BORNIER_MOTEUR_GAUCHE  59.69,82.55 180 top
BORNIER_PORTE_D  21.59,11.43 0 top
BORNIER_PORTE_G  31.75,11.43 0 top
BUZZER  190.47,9.41 0 top
C1  255.27,77.47 270 top
C2  3.81,83.82 180 top
C5  97.79,73.66 90 top
C6  67.33,33.98 0 top
C7  110.43,27.41 270 top
C8  67.27,49.06 270 top
C9  76.84,55.87 90 top
C10  99.5,27.51 270 top
C11  58.11,74.59 0 top
C12  75.03,65.49 90 top
C13  31.32,66.26 90 top
C14  49.73,74.72 180 top
C15  118.11,27.94 270 top
C16  81.28,72.39 270 top
C17  91.44,69.85 0 top
C18  83.24,9.99 180 top
C19  136.75,27.92 270 top
C20  133.35,16.51 270 top
C21  41.91,39.37 270 top
C22  46.99,34.29 0 top
CAPTEUR_US_AR_D  261.61,17.95 180 top
CAPTEUR_US_AR_G  257.81,38.1 180 top
CAPTEUR_US_AV_D  273.05,74.93 180 top
CAPTEUR_US_AV_G  273.05,66.04 180 top
COD_DROIT  247.65,19.05 0 top
COD_GAUCHE  245.54,30.53 90 top
COURSE_D_FER  240.03,5.08 180 top
COURSE_D_OUV  260.7,67.71 270 top
COURSE_G_FER  254,92.71 180 top
COURSE_G_OUV  251.46,11.43 180 top
D2  54.66,23.97 0 top
DC1  101.59,63.46 0 top
DC2  86.36,82.55 90 top
DC3  93.98,16.22 270 top
DC4  119.38,17.78 90 top
DEL_RASP  72.39,11.43 0 top
IC1  19.27,31.35 180 top
IR_AR_D  250.16,67.71 90 top
IR_AR_G  257.81,27.94 180 top
IR_AV_D  261.62,8.89 180 top
IR_AV_G  260.35,46.99 180 top
JP1  213.9,11.05 90 top
JP2  204.49,7.25 180 top
JUMPER  273.05,46.99 180 top
L1  88.9,60.96 90 top
L2  95.87,82.03 180 top
L3  84.47,21.28 270 top
L4  126.63,26.69 270 top
LED1  223.52,7.62 90 top
MOTEUR_DROIT  42.75,70.13 0 top
MOTEUR_GAUCHE  62.82,70.13 0 top
R1  61.13,52.24 90 top
R2  89.17,40.94 90 top
R3  41.08,51.23 90 top
R4  95.4,40.96 270 top
R5  57.7,52.02 90 top
R6  36.83,52.07 90 top
R7  5.72,36.86 270 top
R8  8.76,26 180 top
R9  270.51,10.16 270 top
R10  15.24,62.23 90 top
R11  229.87,7.62 270 top
R12  149.86,17.78 90 top
R13  152.4,17.78 90 top
R14  154.94,17.78 90 top
R15  157.48,17.78 90 top
R16  160.02,17.78 90 top
R17  162.56,17.78 90 top
R18  165.1,17.78 90 top
R19  167.64,17.78 90 top
R20  170.18,17.78 90 top
R21  172.72,17.78 90 top
R22  101.61,38.06 270 top
RASPBERRY  123.4,37.24 180 top
T1  273.05,19.05 0 top
T2  18.84,62.91 90 top
U$1  193.04,55.88 270 top
U$2  161.3,9.69 180 top
UART_RASP  181.61,16.51 0 top

### Tracks (layer width: path | path; a pad name or v marks a point on that pad's centre or on a via)
+3V3
  Top 0.813: U$1.VDD 205.74,83.82 207.01,85.09 234.95,85.09 236.22,83.82 236.22,73.66 237.49,72.39 266.7,72.39 267.97,73.66 BOB-08745.LV
+5V  (via drill 0.6)
  Top 0.813: C21.1 41.91,43.18 | v25.4,43.18 41.91,43.18 | v212.09,16.51 v226.06,16.51 | DC3.3 93,13.68 90.17,16.51 90.17,25.4 88.9,26.67 80.19,26.67 73.84,33.02 73.66,33.02 73.66,40.64 71.12,43.18 41.91,43.18
  Bottom 0.813: 273.05,59.69 CAPTEUR_US_AV_G.2 CAPTEUR_US_AV_D.2 273.05,78.74 | 273.05,59.69 JUMPER.2 273.05,46.25 271.25,43.18 260.35,43.18 | 251.46,13.97 COURSE_G_OUV.2 251.46,8.89 250.19,7.62 241.3,7.62 240.03,6.35 COURSE_D_FER.2 | R11.1 229.87,13.97 | 229.87,13.97 251.46,13.97 | 210.82,16.51 207.01,16.51 205.74,17.78 U$1.5V2 U$1.5V | DC3.3 93.98,4.11 96.82,1.27 184.62,1.27 | 184.62,1.27 204.47,1.27 | 204.47,1.27 209.02,1.27 210.82,3.07 210.82,11.43 | 210.82,11.43 210.82,16.51 | IR_AR_D.2 COURSE_D_OUV.2 263.76,67.71 271.78,59.69 273.05,59.69 | 260.35,43.18 257.81,41.91 CAPTEUR_US_AR_G.2 257.81,34.29 | COD_DROIT.4 251.46,13.97 | 257.81,34.29 252.71,34.29 250.11,34.35 244.27,34.35 COD_GAUCHE.4 | 261.62,12.7 CAPTEUR_US_AR_D.2 261.61,22.66 261.41,22.86 257.81,25.2 IR_AR_G.2 257.81,34.29 | 261.62,12.7 IR_AV_D.2 | 261.62,12.7 259.08,12.7 257.81,13.97 251.46,13.97 | JP1.2 211.2,11.05 210.82,11.43 | 229.87,13.97 227.33,16.51 v226.06,16.51 | IR_AV_G.2 260.35,43.18 | 184.58,1.31 184.62,1.27 | v271.78,80.01 273.05,78.74 | COURSE_G_FER.2 254,93.98 255.27,95.25 267.97,95.25 | 267.97,95.25 278.13,95.25 279.4,93.98 279.4,80.01 278.13,78.74 273.05,78.74 | JP2.2 204.49,1.29 204.47,1.27 | IC1.9 18,40.86 20.32,43.18 v25.4,43.18 | 210.82,16.51 v212.09,16.51 | BOB-08745.HV 267.97,95.25
+5V_RASP
  Bottom 0.813: DC1.3 104.14,50.06 102.34,48.26 88.16,48.26 86.36,46.46 86.36,43.71 88.19,41.87 R22.1 126.96,41.87 127,41.91 RASPBERRY.1
+9V
  Bottom 0.813: 8.89,83.82 AX12-RIGHT-FINGER.2 8.89,76.2 10.16,74.93 17.25,74.93 19.05,76.73 19.05,88.9 20.32,90.17 86.36,90.17 | 8.89,83.82 AX12-RIGHT-ARM.2 | C2.+ 8.89,83.82 | 86.36,90.17 243.34,90.17 245.13,88.4 249.71,83.82 AX12-LEFT-FINGER.2 255.27,83.82 | AX12-LEFT-ARM.2 255.27,83.82 | C1.+ 255.27,83.82 | DC2.3 86.36,90.17
+12V  (via drill 0.8)
  Top 0.813: IC1.4 24.34,32.28 25.68,30.94 v32.73,30.94 | v57.38,30.94 57.39,30.23 58.41,29.22 73.88,29.21 77.47,25.62 77.47,7.92 80.31,5.08 107.42,5.08 109.22,6.88 109.22,18.52 111.02,20.32 DC4.3 137.9,20.32 139.7,18.52 139.7,4.34 141.5,2.54 276.33,2.54 278.13,4.34 278.13,29.94 276.37,31.7 BORNIER_AXE_G.2
  Bottom 0.813: v32.73,30.94 44.45,30.94 | 44.45,30.94 v57.38,30.94 | IC1.4 24.35,35.37 25.4,36.42 30.07,36.42 30.48,36.83 30.48,41.91 24.08,48.31 BORNIER_AXE_D.2 | C22.1 | C22.1 44.45,30.94
+24V  (via drill 2)
  Top 2.04: MOTEUR_GAUCHE.6 63.82,67.35 63.82,69.84 | v81.28,66.04 76.2,70.55 63.82,70.55 63.82,69.84 | 54.61,69.85 54.61,69.84 63.82,69.84
  Top 2.184: MOTEUR_DROIT.6 46.77,69.85 54.61,69.85
  Bottom 2.04: 84.46,29.21 L3.1 81.3,23.78 78.8,21.3 78.75,8.14 76.95,6.35 59.64,6.35 ARRET_URGENCE.2 | 84.46,29.21 84.44,35.89 | 84.44,35.89 R2.1 | C19.+ L4.1 C15.+ C7.+ C10.+ 99.41,29.21 84.46,29.21 | 77.47,54.1 C9.+ 70.81,54.1 70.53,54.1 C8.+ | 77.47,54.1 79.25,54.11 80.98,55.85 80.98,65.75 v81.28,66.04 86.36,66.04 C17.+ 90.17,73.84 L2.1 | MOTEUR_DROIT.6 42.79,65.84 | 84.44,35.89 84.44,41.29 77.47,48.26 77.47,54.09 77.47,54.1
+24V_LIPO
  Bottom 2.04: BORNIER-LIPO.2 ARRET_URGENCE.1 49.55,14 50.8,15.24 58.42,15.24 59.69,13.97 59.69,11.46 ARRET_URGENCE_RASP.1
+24V_RASP  (via drill 2)
  Top 2.04: L1.1 88.9,52.07 78.74,41.91 v76.2,41.91
  Bottom 2.04: v76.2,41.91 67.84,41.91 66.04,40.11 66.04,34 C6.+ 66.06,26.65 66.58,13.61 ARRET_URGENCE_RASP.2
AXE_D  (via drill 0.6)
  Top 0.813: v3.81,53.34 2.54,52.07 2.54,30.48 6.35,26.67 v6.35,21.59 | v106.68,7.62 v92.71,7.62
  Bottom 0.813: U$1.PE3 190.5,17.78 193.04,15.24 196.85,15.24 198.12,13.97 198.12,3.81 196.85,2.54 130.81,2.54 125.73,7.62 v106.68,7.62 | R10.A 10.16,59.69 v3.81,53.34 | v92.71,7.62 86.36,1.27 8.89,1.27 6.35,3.81 v6.35,21.59
AXE_G  (via drill 0.6)
  Top 0.813: v215.9,5.08 214.63,6.35 210.82,6.35 209.55,7.62 209.55,12.7 204.47,17.78 195.58,17.78 v193.04,20.32
  Bottom 0.813: R9.A 267.97,10.16 267.97,3.81 266.7,2.54 218.44,2.54 v215.9,5.08 | v193.04,20.32 U$1.PE5
BUZZER
  Bottom 0.813: BUZZER.1 187.96,17.9 U$1.PE1
COD_DROIT_A  (via drill 0.6)
  Top 0.813: U$1.PB5 177.8,24.13 237.49,24.13 v238.76,22.86 | COD_DROIT.3 248.92,17.78
  Bottom 0.813: v238.76,22.86 247.65,22.86 248.92,21.59 COD_DROIT.3
COD_DROIT_B  (via drill 0.6)
  Top 0.813: v212.09,36.83 212.09,29.98 216.67,25.4 240.03,25.4 243.84,21.59 COD_DROIT.1 | U$1.PB4 177.8,33.76 180.87,36.83 v203.2,36.83
  Bottom 0.813: v203.2,36.83 v212.09,36.83
COD_GAUCHE_A  (via drill 0.8)
  Top 0.813: U$1.PA0 v195.58,69.85 | v217.17,35.56 234.95,35.56 238.76,31.75 244.27,31.75 COD_GAUCHE.3
  Bottom 0.813: v195.58,69.85 195.58,63.5 199.39,59.69 199.39,36.09 199.92,35.56 v217.17,35.56
COD_GAUCHE_B  (via drill 0.8)
  Top 0.813: U$1.PA1 196.85,81.28 v196.85,66.04 | v220.98,33.02 220.98,29.52 223.83,26.68 COD_GAUCHE.1
  Bottom 0.813: v196.85,66.04 218.14,66.04 220.98,63.2 v220.98,33.02
COURSE_D_FER  (via drill 0.8)
  Top 0.813: v199.39,19.05 231.14,19.05 233.68,16.51 233.68,8.89 COURSE_D_FER.3
  Bottom 0.813: U$1.PC13 195.58,20.85 197.38,19.05 v199.39,19.05
COURSE_D_OUV
  Top 0.813: U$1.PC0 200.66,64.03 202.46,62.23 259.08,62.23 COURSE_D_OUV.3
COURSE_G_FER
  Top 0.813: U$1.PC1 200.66,90.17 203.2,92.71 COURSE_G_FER.3
COURSE_G_OUV  (via drill 0.8)
  Top 0.813: v199.39,21.29 201.9,21.32 235.87,21.32 237.46,19.73 237.49,12.7 238.76,11.43 COURSE_G_OUV.3
  Bottom 0.813: U$1.PC15 198.12,22.56 v199.39,21.29
ENABLE_PORTE_D
  Top 0.813: 5.74,49.53 5.72,72.21 6.91,73.4 24.06,73.37 25.64,74.95 25.67,92.28 27.03,93.63 176.43,93.43 179.08,90.77 179.07,81.28 U$1.PB2 | IC1.11 15.46,39.81 5.74,49.53 | R7.1 5.74,41.95 5.74,49.53
ENABLE_PORTE_G  (via drill 0.8)
  Top 0.813: v90.17,31.75 v82.55,31.75 | 21.81,27.17 IC1.6 | R8.1 15.11,27.17 21.81,27.17 | v57.15,27.94 v69.85,27.94 | 21.81,27.17 33.02,27.17 v33.02,27.94 | U$1.PB0 180.34,77.47 180.34,39.37 175.26,34.29 142.24,34.29 v139.7,31.75
  Bottom 0.813: v139.7,31.75 v90.17,31.75 | v82.55,31.75 81.28,30.48 71.65,30.48 69.85,28.68 v69.85,27.94 | v33.02,27.94 v57.15,27.94
GND
  pour Bottom: -2.54,99.06 281.94,99.06 281.94,0 -1.27,0
  pour Top: -2.54,97.79 283.21,96.52 283.21,0 -3.81,0
IR_AR_D
  Bottom 0.813: U$1.PC4 185.42,74.93 186.69,73.66 233.68,73.66 237.09,70.25 238.76,70.25 | IR_AR_D.3 238.76,70.25 | 238.76,70.25 238.68,70.25
IR_AR_G  (via drill 0.8)
  Top 0.813: IR_AR_G.3 255.27,34.29 251.46,38.1 251.46,46.99 250.19,48.26 v224.79,48.26 | U$1.PC2 v198.12,69.85
  Bottom 0.813: v198.12,69.85 219.41,69.85 222.25,67.01 222.25,50.06 224.05,48.26 v224.79,48.26
IR_AV_D  (via drill 0.8)
  Top 0.813: v186.69,77.47 186.69,69.85 198.12,58.42 198.12,47.52 199.92,45.72 246.38,45.72 247.08,45.02 247.08,36.67 251.46,32.29 251.46,22.46 259.08,14.84 IR_AV_D.3
  Bottom 0.813: U$1.PC5 186.69,81.28 v186.69,77.47
IR_AV_G  (via drill 0.8)
  Top 0.813: U$1.PC3 199.39,81.28 v199.39,72.39 | v229.87,50.8 255.27,50.8 IR_AV_G.3 | v224.79,64.77 224.79,70.76 223.16,72.39 v203.2,72.39
  Bottom 0.813: v229.87,50.8 226.59,50.8 224.79,52.6 v224.79,64.77 | v199.39,72.39 v203.2,72.39
JP1
  Bottom 0.813: JP2.3 201.93,7.27 201.93,27.94 U$1.PH1
JP2
  Bottom 0.813: U$1.PH0 201.93,33.02 210.23,33.02 213.89,29.36 JP1.3
JUMPER
  Bottom 0.813: JUMPER.3 266.7,46.99 264.16,49.53 240.56,49.53 238.76,47.73 238.76,34.29 234.95,30.48 218.44,30.48 214.63,34.29 200.66,34.29 U$1.PC14
MOTEUR_DROIT_DIR  (via drill 0.8)
  Top 0.813: R6.2 31.01,57.15 29.21,58.95 29.21,88.9 30.48,90.17 135.89,90.17 137.16,88.9 v139.7,88.9
  Bottom 0.813: R6.2 37.64,58.08 MOTEUR_DROIT.3 | U$1.PD12 153.67,81.28 153.67,87.63 152.4,88.9 v139.7,88.9
MOTEUR_DROIT_PWM  (via drill 0.8)
  Top 0.813: v81.28,50.8 72.39,50.8 68.66,53.91 53.4,53.91 52.27,55.04 R3.2 | v95.25,50.8 v139.7,50.8
  Bottom 0.813: MOTEUR_DROIT.5 R3.2 | v139.7,50.8 191.24,50.8 193.04,49 U$1.PE4 | v95.25,50.8 v81.28,50.8
MOTEUR_GAUCHE_DIR  (via drill 0.8)
  Top 0.813: v139.7,81.28 136.16,81.28 132.12,85.36 130.74,86.75 73.22,86.77 71.11,84.65 71.12,78.74 v66.04,72.39
  Bottom 0.813: v139.7,81.28 151.13,81.28 U$1.PD14 | v66.04,72.39 63.5,69.85 62.23,69.84 61.4,69.84 58.16,67.29 57.75,65.63 MOTEUR_GAUCHE.3 57.72,60.21 R5.2
MOTEUR_GAUCHE_PWM  (via drill 0.8)
  Top 0.813: MOTEUR_GAUCHE.5 v61.13,58.42 71.12,58.42 74.93,60.96 92.71,60.96 96.52,58.42 v139.7,58.42
  Bottom 0.813: v61.13,58.42 R1.2 | v139.7,58.42 193.78,58.42 195.58,56.62 U$1.PE6
N$1
  Bottom 0.813: R10.S 13.38,62.91 T2.B
N$2
  Bottom 0.813: R9.S T1.B
N$3  (via drill 0.6)
  Top 0.813: DEL_RASP.1 69.85,11.41 69.85,3.81 72.39,1.27 99.06,1.27 v100.33,2.54 | v105.41,19.05 105.41,30.48 101.64,34.25 R22.2
  Bottom 0.813: v100.33,2.54 105.41,7.62 v105.41,19.05
N$4
  Bottom 2.04: BORNIER-LIPO.1 39.39,16.32 D2.C
N$5
  Bottom 0.813: T1.C 271.78,20.32 BORNIER_AXE_G.1
N$6
  Bottom 0.813: R11.2 LED1.A
N$7
  Bottom 0.813: IC1.14 11.56,25.12 11.56,18.94 BORNIER_PORTE_D.1
N$8
  Bottom 0.813: MOTEUR_DROIT.11 52.27,61.77 C14.1
N$9
  Bottom 2.04: BORNIER_MOTEUR_GAUCHE.1 66.95,82.56 69.39,80.13 69.44,68.04 | MOTEUR_GAUCHE.10 69.61,68.04 69.44,68.04 | 69.44,68.04 C12.2
N$10
  Bottom 0.813: MOTEUR_GAUCHE.1 54.28,62.87 54.32,72.79 55.57,74.04 C11.1
N$11
  Bottom 2.04: MOTEUR_DROIT.2 35.95,68.58 | 35.95,68.58 35.95,69.72 35.95,80.04 38.42,82.52 BORNIER_MOTEUR_DROIT.2 | C13.2 35.95,68.8 35.95,68.58
N$12
  Bottom 2.04: MOTEUR_DROIT.10 47.19,68.2 C14.2 52.05,79.58 BORNIER_MOTEUR_DROIT.1
N$13
  Bottom 2.04: DC4.1 124.09,15.22 126.62,17.73 126.62,17.78 | 126.62,17.78 L4.2 | C20.+ 126.62,17.78
N$14
  Bottom 0.813: MOTEUR_DROIT.1 32.24,63.55 C13.1
N$15
  Bottom 2.04: L1.2 91.4,63.46 91.44,63.5 DC1.1 99.05,71.13 C5.+
N$16
  Bottom 2.04: MOTEUR_GAUCHE.2 56.02,68.69 60.65,73.32 C11.2 57.2,78.04 BORNIER_MOTEUR_GAUCHE.2
N$18
  Bottom 2.04: C18.+ L3.2 DC3.1
N$22
  Bottom 0.813: MOTEUR_GAUCHE.11 C12.1
N$24
  Bottom 2.04: C16.+ 81.28,78.74 82.55,80.01 DC2.1 91.34,80.01 L2.2
N$31
  Bottom 0.254: U$2.10 R12.1
N$32
  Bottom 0.254: U$2.9 R13.1
N$33
  Bottom 0.813: BORNIER_AXE_D.1 16.51,54.61 19.05,57.15 19.05,60.16 T2.C
N$34
  Bottom 0.254: R14.1 U$2.8
N$35
  Top 0.813: IC1.2 33.8,33.94 34.97,32.77 34.91,25.4 29.23,19.73 BORNIER_PORTE_G.1
N$36
  Bottom 0.254: R15.1 U$2.7
N$37
  Top 0.813: IC1.3 26.67,36.83 29.21,35.56 35.56,35.56 36.83,34.29 36.83,14.02 BORNIER_PORTE_G.2
N$38
  Top 0.813: IC1.13 12.92,40.48 11.43,41.97 9.7,41.97 8.2,40.47 8.25,5.23 9.68,3.79 21.57,3.79 24.08,6.3 BORNIER_PORTE_D.2
N$40
  Bottom 0.254: U$2.6 R16.1
N$41
  Bottom 0.254: U$2.5 R17.1
N$42
  Bottom 0.254: U$2.4 R18.1
N$43
  Bottom 0.254: U$2.3 R19.1
N$44
  Bottom 0.254: U$2.2 R20.1
N$45
  Bottom 0.254: R21.1 U$2.1
PORTE_D_FER  (via drill 0.8)
  Top 0.813: IC1.12 13.97,33.68 13.97,29.21 12.7,27.94 v10.16,27.94 | v78.74,88.9 134.62,88.9 142.24,81.28 166.37,81.28 U$1.PE15
  Bottom 0.813: v10.16,27.94 3.81,27.94 2.54,29.21 2.54,69.85 3.81,71.12 22.86,71.12 24.13,72.39 24.13,85.83 27.2,88.9 v78.74,88.9
PORTE_D_OUV  (via drill 0.8)
  Top 0.813: U$1.PE13 171.45,81.28 171.45,49.53 168.91,46.99 v168.91,36.83 | v74.93,3.81 v135.89,3.81
  Bottom 0.813: IC1.10 16.51,33.68 16.51,30.48 17.78,29.21 26.67,29.21 31.75,24.13 31.75,6.88 34.82,3.81 v74.93,3.81 | v135.89,3.81 135.89,10.16 142.24,16.51 142.24,30.48 146.05,34.29 166.37,34.29 v168.91,36.83
PORTE_G_FER  (via drill 0.8)
  Top 0.813: IC1.7 20.93,39.37 21.59,40.64 21.59,42.65 23.39,44.45 26.67,47.73 v26.67,53.34 | v26.67,67.31 27.41,68.05 27.41,90.68 28.46,91.73 170.19,91.73 172.72,89.21 U$1.PE11
  Bottom 0.813: v26.67,53.34 v26.67,67.31
PORTE_G_OUV  (via drill 0.8)
  Top 0.813: IC1.5 22.86,39.19 22.86,40.64 23.75,41.53 35.94,41.53 38.1,39.37 60.96,39.37 62.23,38.1 v69.85,38.1 | v80.01,38.1 81.28,39.37 v139.7,39.37 | v176.53,39.37 176.53,81.28 U$1.PE9
  Bottom 0.813: v69.85,38.1 v80.01,38.1 | v139.7,39.37 v176.53,39.37
R1
  Bottom 0.813: R21.2 U$1.PD6
R2
  Bottom 0.813: R20.2 U$1.PD4
R3
  Bottom 0.813: R19.2 U$1.PD2
R4
  Bottom 0.813: R18.2 U$1.PD0
R5
  Bottom 0.813: R17.2 U$1.PC11
R6
  Bottom 0.813: R16.2 U$1.PA15
R7
  Bottom 0.406: R15.2 157.48,23.41 158.79,24.72 158.79,30.44 U$1.PA10
R8
  Bottom 0.406: R14.2 154.94,26.67 153.67,27.94 153.67,30.48 U$1.PC8
R9
  Bottom 0.813: R13.2 U$1.PC9
R10
  Bottom 0.813: R12.2 U$1.PC7
TEST_LIPO  (via drill 0.8)
  Top 0.813: v182.88,73.66 v182.78,46.06
  Bottom 0.813: v182.78,46.06 R4.1 94.15,46.02 | U$1.PA3 193.04,83.3 191.83,84.51 185.48,84.51 184.15,83.19 184.15,74.93 v182.88,73.66
  Bottom 2.04: R2.2 94.15,46.02
UART_AX12  (via drill 0.8)
  Top 0.813: v240.03,86.36 241.3,88.9 261.62,88.9 262.89,87.63 BOB-08745.TXI-1
  Bottom 0.813: v240.03,86.36 219.71,86.36 214.63,81.28 194.31,81.28 U$1.PA2
UART_AX12-BOB
  Bottom 0.813: AX12-RIGHT-FINGER.3 AX12-RIGHT-ARM.3 11.43,90.68 12.7,91.95 245.84,91.96 248.92,88.92 248.92,88.9 250.19,88.9 | AX12-LEFT-ARM.3 AX12-LEFT-FINGER.3 250.19,88.9 | 250.19,88.9 260.05,88.9 BOB-08745.TXO-1
UART_JAUNE
  Bottom 0.813: UART_RASP.3 184.15,19.05 181.61,21.59 181.61,30.48 U$1.PB6
UART_ROUGE
  Bottom 0.813: U$1.PB7 180.34,20.32 181.61,19.05 UART_RASP.2
US_AR_D
  Top 0.813: U$1.PA6 187.96,71.12 200.66,58.42 200.66,48.79 202.46,46.99 247.65,46.99 248.92,45.72 248.92,37.42 252.73,33.61 252.73,24.29 CAPTEUR_US_AR_D.3
US_AR_G  (via drill 0.6, 0.8)
  Top 0.813: v227.33,59.69 227.33,50.8 228.6,49.53 251.46,49.53 252.73,48.26 252.73,41.91 CAPTEUR_US_AR_G.3 | v227.33,76.2 v227.33,64.77
  Bottom 0.813: U$1.PA4 190.5,78 192.3,76.2 v227.33,76.2 | v227.33,59.69 v227.33,64.77
US_AV_D
  Bottom 0.813: U$1.PA5 191.77,81.28 191.77,79.27 193.57,77.47 235.69,77.47 239.5,73.66 266.7,73.66 267.97,74.93 CAPTEUR_US_AV_D.3
US_AV_G
  Bottom 0.813: U$1.PA7 189.23,81.28 189.23,76.73 191.03,74.93 234.95,74.93 237.49,72.39 265.43,72.39 270.51,67.31 CAPTEUR_US_AV_G.3

### Text on the board
bNames: ARRIERE | DROITE | GAUCHE | AVANT